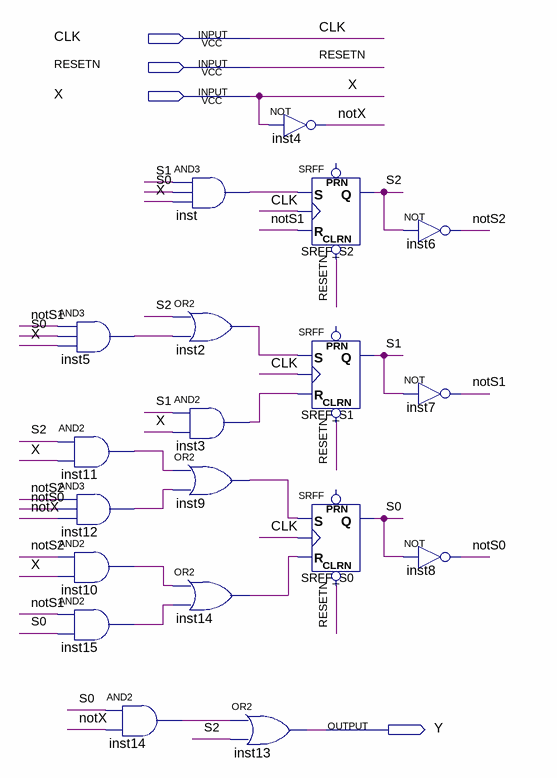
[diagram p0: schematic sheet]
// Quartus schematic Q3aSR.bdf as structural Verilog: 19 symbols, 4 pins
module Q3aSR (
  input  CLK,
  input  RESETN,
  input  X,
  output Y
);

  wire inst2_out, inst3_out, inst5_out, inst9_out, inst10_out, inst11_out, inst12_out, inst14_out,
       inst14_out_2, inst15_out, inst_out, notS0, notS1, notS2, notX, S0, S1, S2;

  and inst5 (inst5_out, notS1, S0, X);
  and inst11 (inst11_out, S2, X);
  and inst12 (inst12_out, notS2, notS0, notX);
  and inst10 (inst10_out, notS2, X);
  and inst15 (inst15_out, notS1, S0);
  and inst14 (inst14_out_2, S0, notX);
  and inst (inst_out, S1, S0, X);
  or inst2 (inst2_out, S2, inst5_out);
  and inst3 (inst3_out, S1, X);
  or inst9 (inst9_out, inst11_out, inst12_out);
  or inst14_dup2 (inst14_out, inst10_out, inst15_out);
  or inst13 (Y, inst14_out_2, S2);
  not inst4 (notX, X);
  SRFF SRFF_S2 (.CLRN(RESETN), .S(inst_out), .R(notS1), .CLK(CLK), .Q(S2));  // open: PRN
  SRFF SRFF_S1 (.CLRN(RESETN), .S(inst2_out), .R(inst3_out), .CLK(CLK), .Q(S1));  // open: PRN
  SRFF SRFF_S0 (.CLRN(RESETN), .S(inst9_out), .R(inst14_out), .CLK(CLK), .Q(S0));  // open: PRN
  not inst6 (notS2, S2);
  not inst7 (notS1, S1);
  not inst8 (notS0, S0);
endmodule
